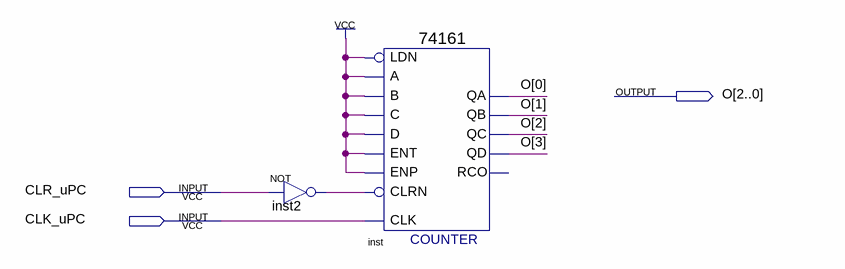
[diagram p0: schematic sheet]
// Quartus schematic uPC.bdf as structural Verilog: 2 symbols, 3 pins
module uPC (
  input  CLR_uPC,
  input  CLK_uPC,
  output [3:0] O
);

  wire inst2_out;

  not inst2 (inst2_out, CLR_uPC);
  \74161  inst (
    .CLRN(inst2_out), .CLK(CLK_uPC), .ENP(1'b1), .LDN(1'b1), .A(1'b1), .D(1'b1), .ENT(1'b1), .B(1'b1),
    .C(1'b1), .QD(O[3]), .QC(O[2]), .QB(O[1]), .QA(O[0]));  // open: RCO
endmodule
